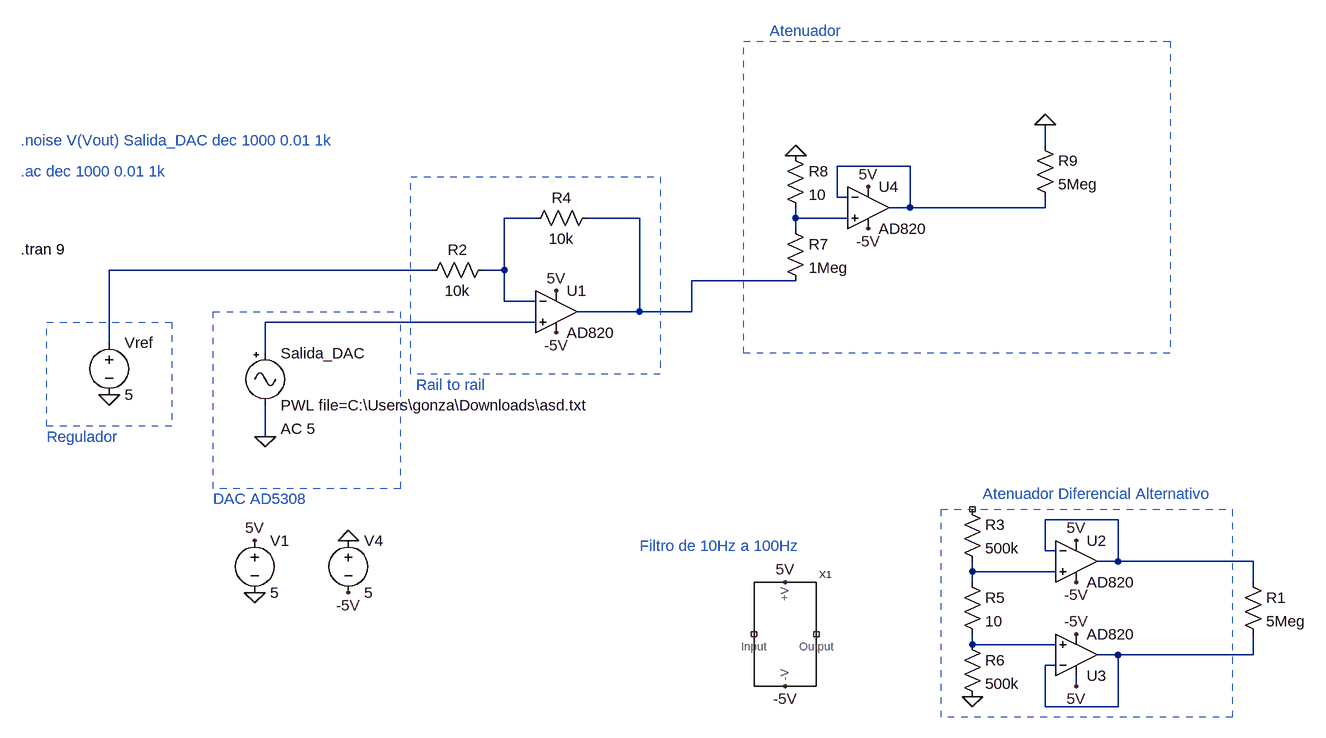
[diagram p0: schematic Atenuador.asc]
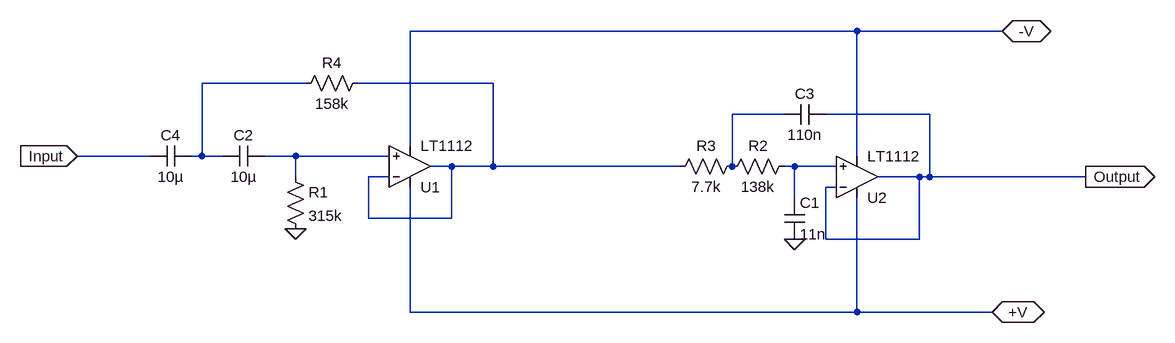
[diagram p1: sub-circuit bandpassfilter.asc]
Atenuador.asc, the LTspice schematic file:
Version 4
SHEET 1 2028 856
WIRE 1200 -160 1200 -192
WIRE 992 -128 880 -128
WIRE 880 -80 880 -128
WIRE 896 -80 880 -80
WIRE 992 -64 992 -128
WIRE 992 -64 960 -64
WIRE 1200 -64 1200 -80
WIRE 1200 -64 992 -64
WIRE 416 -48 368 -48
WIRE 576 -48 496 -48
WIRE 816 -48 816 -64
WIRE 896 -48 816 -48
WIRE 816 -32 816 -48
WIRE 256 32 -240 32
WIRE 368 32 368 -48
WIRE 368 32 336 32
WIRE 816 48 656 48
WIRE 368 80 368 32
WIRE 416 80 368 80
WIRE 576 96 576 -48
WIRE 576 96 480 96
WIRE 656 96 656 48
WIRE 656 96 576 96
WIRE 416 112 0 112
WIRE -240 144 -240 32
WIRE 0 160 0 112
WIRE 0 288 0 240
WIRE 1312 416 1200 416
WIRE 1200 464 1200 416
WIRE 1216 464 1200 464
WIRE 1312 480 1312 416
WIRE 1312 480 1280 480
WIRE 1520 480 1312 480
WIRE 1088 496 1088 480
WIRE 1216 496 1088 496
WIRE 1088 512 1088 496
WIRE 1520 512 1520 480
WIRE 1088 608 1088 592
WIRE 1216 608 1088 608
WIRE 1312 624 1280 624
WIRE 1520 624 1520 592
WIRE 1520 624 1312 624
WIRE 1216 640 1200 640
WIRE 1248 672 1248 656
WIRE 1200 704 1200 640
WIRE 1312 704 1312 624
WIRE 1312 704 1200 704
FLAG 0 288 0
FLAG -240 224 0
FLAG -16 528 0
FLAG 128 448 0
FLAG -16 448 5V
FLAG 128 528 -5V
FLAG 448 64 5V
FLAG 448 128 -5V
FLAG 1088 688 0
FLAG 1248 512 -5V
FLAG 1248 448 5V
FLAG 800 512 5V
FLAG 800 672 -5V
FLAG 1248 592 -5V
FLAG 1248 672 5V
FLAG 816 -144 0
FLAG 928 -32 -5V
FLAG 928 -96 5V
FLAG 1200 -192 0
SYMBOL Misc\\signal 0 144 R0
WINDOW 123 24 132 Left 2
WINDOW 39 0 0 Left 0
SYMATTR Value2 AC 5
SYMATTR InstName Salida_DAC
SYMATTR Value PWL file=C:\Users\gonza\Downloads\asd.txt
SYMBOL voltage -240 128 R0
WINDOW 123 0 0 Left 0
WINDOW 39 0 0 Left 0
SYMATTR InstName Vref
SYMATTR Value 5
SYMBOL Opamps\\AD820 448 32 R0
SYMATTR InstName U1
SYMBOL res 240 48 R270
WINDOW 0 32 56 VTop 2
WINDOW 3 0 56 VBottom 2
SYMATTR InstName R2
SYMATTR Value 10k
SYMBOL res 512 -64 R90
WINDOW 0 0 56 VBottom 2
WINDOW 3 32 56 VTop 2
SYMATTR InstName R4
SYMATTR Value 10k
SYMBOL voltage -16 432 R0
WINDOW 123 0 0 Left 0
WINDOW 39 0 0 Left 0
SYMATTR InstName V1
SYMATTR Value 5
SYMBOL voltage 128 432 R0
WINDOW 123 0 0 Left 0
WINDOW 39 0 0 Left 0
SYMATTR InstName V4
SYMATTR Value 5
SYMBOL res 1072 384 R0
SYMATTR InstName R3
SYMATTR Value 500k
SYMBOL res 1072 496 R0
SYMATTR InstName R5
SYMATTR Value 10
SYMBOL Opamps\\AD820 1248 416 R0
SYMATTR InstName U2
SYMBOL BandPassFilter 800 592 R0
SYMATTR InstName X1
SYMBOL res 1504 496 R0
SYMATTR InstName R1
SYMATTR Value 5Meg
SYMBOL res 1072 592 R0
SYMATTR InstName R6
SYMATTR Value 500k
SYMBOL Opamps\\AD820 1248 688 M180
SYMATTR InstName U3
SYMBOL res 800 -48 R0
SYMATTR InstName R7
SYMATTR Value 1Meg
SYMBOL res 800 -160 R0
SYMATTR InstName R8
SYMATTR Value 10
SYMBOL Opamps\\AD820 928 -128 R0
SYMATTR InstName U4
SYMBOL res 1184 -176 R0
SYMATTR InstName R9
SYMATTR Value 5Meg
TEXT -376 -120 Left 2 ;.ac dec 1000 0.01 1k
TEXT -336 288 Left 2 ;Regulador
TEXT -80 384 Left 2 ;DAC AD5308
TEXT 232 208 Left 2 ;Rail to rail
TEXT 1104 376 Left 2 ;Atenuador Diferencial Alternativo
TEXT -376 -168 Left 2 ;.noise V(Vout) Salida_DAC dec 1000 0.01 1k
TEXT -376 0 Left 2 !.tran 9
TEXT 776 -336 Left 2 ;Atenuador
TEXT 576 456 Left 2 ;Filtro de 10Hz a 100Hz
RECTANGLE Normal -144 272 -336 112 2
RECTANGLE Normal 208 368 -80 96 2
RECTANGLE Normal 608 192 224 -112 2
RECTANGLE Normal 1488 720 1040 400 2
RECTANGLE Normal 1392 160 736 -320 2

bandpassfilter.asc, the sub-circuit schematic file:
Version 4
SHEET 1 1844 680
WIRE 880 -16 192 -16
WIRE 1104 -16 880 -16
WIRE 32 64 -128 64
WIRE 320 64 112 64
WIRE 768 112 688 112
WIRE 992 112 832 112
WIRE 192 160 192 -16
WIRE -208 176 -320 176
WIRE -128 176 -128 64
WIRE -128 176 -144 176
WIRE -96 176 -128 176
WIRE 16 176 -32 176
WIRE 160 176 16 176
WIRE 880 176 880 -16
WIRE 256 192 224 192
WIRE 320 192 320 64
WIRE 320 192 256 192
WIRE 608 192 320 192
WIRE 688 192 688 112
WIRE 784 192 768 192
WIRE 848 192 784 192
WIRE 16 208 16 176
WIRE 160 208 128 208
WIRE 976 208 912 208
WIRE 992 208 992 112
WIRE 992 208 976 208
WIRE 1232 208 992 208
WIRE 848 224 832 224
WIRE 784 240 784 192
WIRE 128 272 128 208
WIRE 256 272 256 192
WIRE 256 272 128 272
WIRE 832 304 832 224
WIRE 976 304 976 208
WIRE 976 304 832 304
WIRE 192 416 192 224
WIRE 880 416 880 240
WIRE 880 416 192 416
WIRE 1088 416 880 416
FLAG -320 176 Input
IOPIN -320 176 In
FLAG 1232 208 Output
IOPIN 1232 208 Out
FLAG 1088 416 +V
IOPIN 1088 416 BiDir
FLAG 1104 -16 -V
IOPIN 1104 -16 BiDir
FLAG 784 304 0
FLAG 16 288 0
SYMBOL Opamps\\LT1112 192 256 M180
SYMATTR InstName U1
SYMBOL Opamps\\LT1112 880 272 M180
SYMATTR InstName U2
SYMBOL res 784 176 R90
WINDOW 0 0 56 VBottom 2
WINDOW 3 32 56 VTop 2
SYMATTR InstName R2
SYMATTR Value 138k
SYMBOL res 704 176 R90
WINDOW 0 0 56 VBottom 2
WINDOW 3 32 56 VTop 2
SYMATTR InstName R3
SYMATTR Value 7.7k
SYMBOL cap 768 240 R0
SYMATTR InstName C1
SYMATTR Value 11n
SYMBOL cap 832 96 R90
WINDOW 0 0 32 VBottom 2
WINDOW 3 32 32 VTop 2
SYMATTR InstName C3
SYMATTR Value 110n
SYMBOL res 0 192 R0
SYMATTR InstName R1
SYMATTR Value 315k
SYMBOL res 128 48 R90
WINDOW 0 0 56 VBottom 2
WINDOW 3 32 56 VTop 2
SYMATTR InstName R4
SYMATTR Value 158k
SYMBOL cap -32 160 R90
WINDOW 0 0 32 VBottom 2
WINDOW 3 32 32 VTop 2
SYMATTR InstName C2
SYMATTR Value 10µ
SYMBOL cap -144 160 R90
WINDOW 0 0 32 VBottom 2
WINDOW 3 32 32 VTop 2
SYMATTR InstName C4
SYMATTR Value 10µ

The netlist it stands for:
* Atenuador.asc
V§Salida_DAC N006 0 PWL file=C:\Users\gonza\Downloads\asd.txt AC 5
Vref N005 0 5
XU1 N006 N002 5V -5V N003 AD820  ; pins In+ In- V+ V- OUT
R2 N005 N002 10k
R4 N003 N002 10k
V1 5V 0 5
V4 0 -5V 5
R3 NC_01 N008 500k
R5 N008 N009 10
XU2 N008 N007 5V -5V N007 AD820  ; pins In+ In- V+ V- OUT
XX1 NC_02 5V -5V NC_03 bandpassfilter
R1 N007 N010 5Meg
R6 N009 0 500k
XU3 N009 N010 5V -5V N010 AD820  ; pins In+ In- V+ V- OUT
R7 N004 N003 1Meg
R8 0 N004 10
XU4 N004 N001 5V -5V N001 AD820  ; pins In+ In- V+ V- OUT
R9 0 N001 5Meg

* block symbol definitions
.subckt bandpassfilter Input +V -V Output
XU1 N004 N002 +V -V N002 LT1112  ; pins In+ In- V+ V- OUT
XU2 N005 Output +V -V Output LT1112  ; pins In+ In- V+ V- OUT
R2 N005 N003 138k
R3 N003 N002 7.7k
C1 N005 0 11n
C3 Output N003 110n
R1 N004 0 315k
R4 N002 N001 158k
C2 N004 N001 10µ
C4 N001 Input 10µ
.ends bandpassfilter

* .ac dec 1000 0.01 1k
* Regulador
* DAC AD5308
* Rail to rail
* Atenuador Diferencial Alternativo
* .noise V(Vout) Salida_DAC dec 1000 0.01 1k
.tran 9
* Atenuador
* Filtro de 10Hz a 100Hz
.lib LTC.lib
.backanno
.end